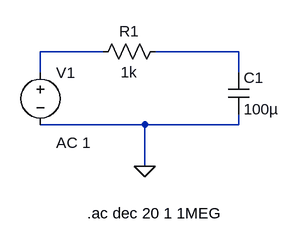
[diagram p0: schematic LPF.asc]
LPF.asc, the LTspice schematic file:
Version 4
SHEET 1 880 680
WIRE 80 32 -16 32
WIRE 288 32 160 32
WIRE -16 64 -16 32
WIRE 288 64 288 32
WIRE 144 144 -16 144
WIRE 288 144 288 128
WIRE 288 144 144 144
WIRE 144 208 144 144
FLAG 144 208 0
SYMBOL res 176 16 R90
WINDOW 0 0 56 VBottom 2
WINDOW 3 32 56 VTop 2
SYMATTR InstName R1
SYMATTR Value 1k
SYMBOL voltage -16 48 R0
WINDOW 123 24 124 Left 2
WINDOW 39 0 0 Left 2
SYMATTR Value2 AC 1
SYMATTR InstName V1
SYMATTR Value ""
SYMBOL cap 272 64 R0
SYMATTR InstName C1
SYMATTR Value 100µ
TEXT 56 280 Left 2 !.ac dec 20 1 1MEG

The netlist it stands for:
* LPF.asc
R1 N002 N001 1k
V1 N001 0 AC 1
C1 N002 0 100µ
.ac dec 20 1 1MEG
.backanno
.end